# EAGLE schematic dpad (EAGLE 9.6.2)
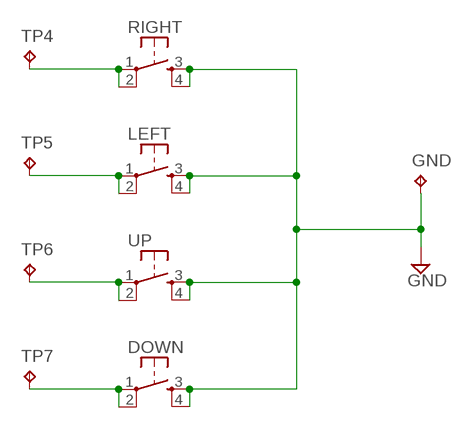
[diagram p0: schematic, sheet 1]

## Parts
DOWN  BUTTON  [SMD_BUTTON]
GND  TPPAD1-13  [P1-13]
LEFT  BUTTON  [SMD_BUTTON]
RIGHT  BUTTON  [SMD_BUTTON]
TP4  TESTPAD  [TESTPAD]
TP5  TESTPAD  [TESTPAD]
TP6  TESTPAD  [TESTPAD]
TP7  TESTPAD  [TESTPAD]
UP  BUTTON  [SMD_BUTTON]

## Nets
GND: DOWN.3(S) DOWN.4(S1) GND.TP LEFT.3(S) LEFT.4(S1) RIGHT.3(S) RIGHT.4(S1) UP.3(S) UP.4(S1)
N$1: TP6.P$1(TP) UP.1(P) UP.2(P1)
N$2: LEFT.1(P) LEFT.2(P1) TP5.P$1(TP)
N$3: RIGHT.1(P) RIGHT.2(P1) TP4.P$1(TP)
N$4: DOWN.1(P) DOWN.2(P1) TP7.P$1(TP)

## Library data of the parts
DOWN LEFT RIGHT UP = lib:BUTTON: Button; MPN: B3F-1000; OC_FARNELL: 176432; OC_NEWARK: 36M3542
GND = testpad:TP: Test pad
TP4-TP7 = lib:TESTPAD